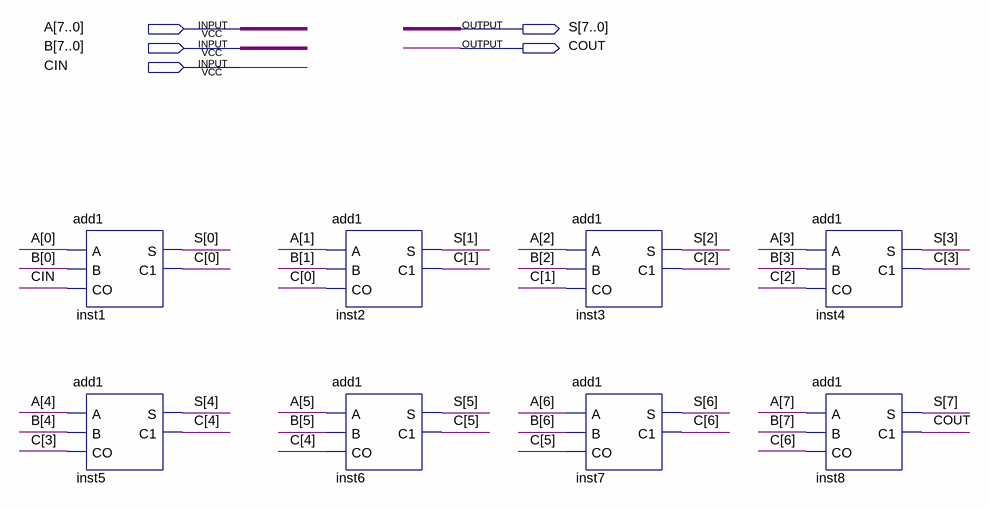
[diagram p0: schematic sheet]
// Quartus schematic add8.bdf as structural Verilog: 8 symbols, 5 pins
module add8 (
  input  [7:0] A,
  input  [7:0] B,
  input  CIN,
  output [7:0] S,
  output COUT
);

  wire [6:0] C;

  add1 inst1 (.A(A[0]), .B(B[0]), .CO(CIN), .S(S[0]), .C1(C[0]));
  add1 inst5 (.A(A[4]), .B(B[4]), .CO(C[3]), .S(S[4]), .C1(C[4]));
  add1 inst2 (.A(A[1]), .B(B[1]), .CO(C[0]), .S(S[1]), .C1(C[1]));
  add1 inst6 (.A(A[5]), .B(B[5]), .CO(C[4]), .S(S[5]), .C1(C[5]));
  add1 inst3 (.A(A[2]), .B(B[2]), .CO(C[1]), .S(S[2]), .C1(C[2]));
  add1 inst7 (.A(A[6]), .B(B[6]), .CO(C[5]), .S(S[6]), .C1(C[6]));
  add1 inst4 (.A(A[3]), .B(B[3]), .CO(C[2]), .S(S[3]), .C1(C[3]));
  add1 inst8 (.A(A[7]), .B(B[7]), .CO(C[6]), .S(S[7]), .C1(COUT));
endmodule
